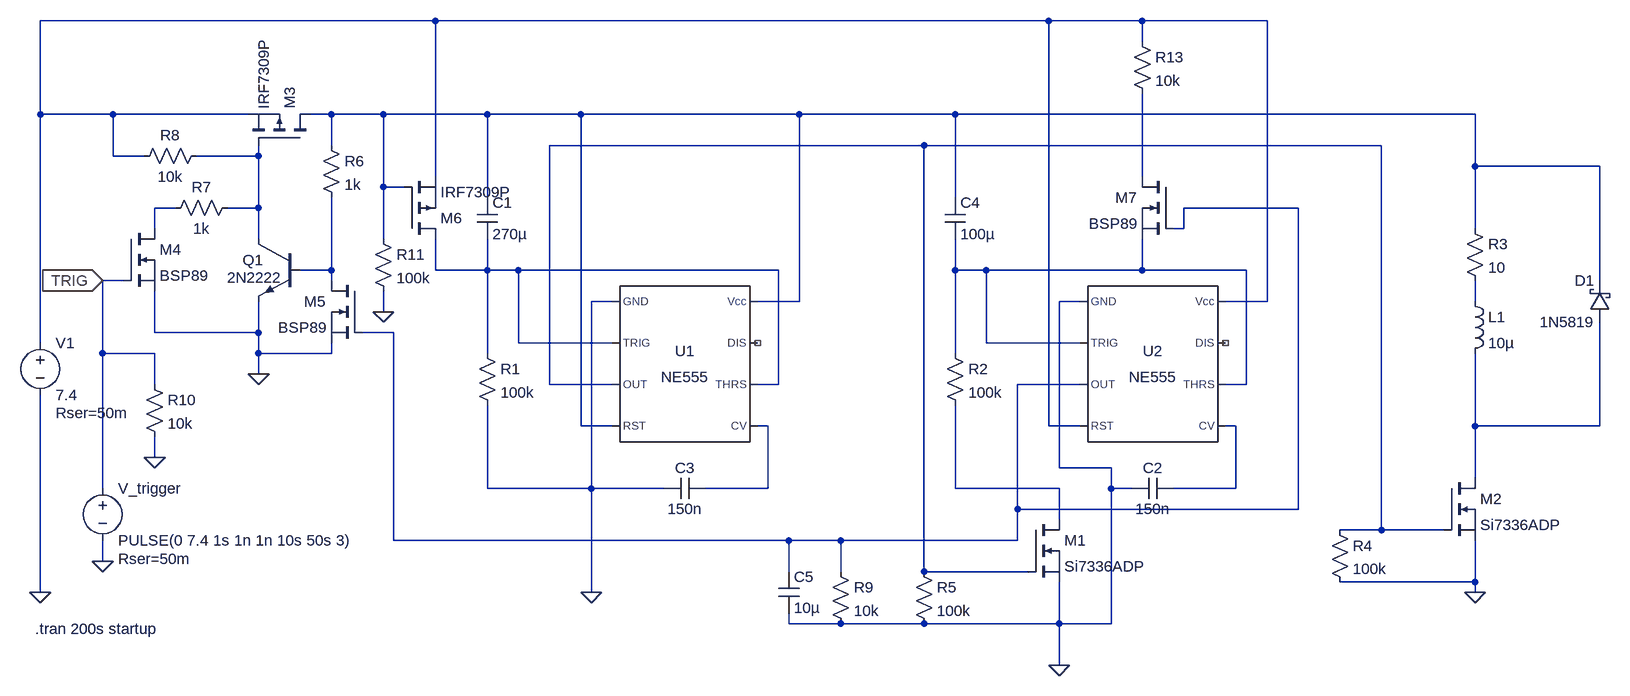
[diagram p0: schematic delayed_on_off_3.asc]
delayed_on_off_3.asc, the LTspice schematic file:
Version 4
SHEET 1 1796 680
WIRE -16 -336 -624 -336
WIRE 928 -336 -16 -336
WIRE 1072 -336 928 -336
WIRE 1264 -336 1072 -336
WIRE 1072 -304 1072 -336
WIRE -624 -192 -624 -336
WIRE -512 -192 -624 -192
WIRE -304 -192 -512 -192
WIRE -176 -192 -208 -192
WIRE -96 -192 -176 -192
WIRE 64 -192 -96 -192
WIRE 208 -192 64 -192
WIRE 544 -192 208 -192
WIRE 784 -192 544 -192
WIRE 1584 -192 784 -192
WIRE -176 -144 -176 -192
WIRE 736 -144 160 -144
WIRE 1440 -144 736 -144
WIRE -512 -128 -512 -192
WIRE -464 -128 -512 -128
WIRE -288 -128 -288 -144
WIRE -288 -128 -384 -128
WIRE 1584 -112 1584 -192
WIRE 1776 -112 1584 -112
WIRE -16 -96 -16 -336
WIRE 1072 -96 1072 -224
WIRE -96 -80 -96 -192
WIRE -64 -80 -96 -80
WIRE 64 -64 64 -192
WIRE 784 -64 784 -192
WIRE -416 -48 -448 -48
WIRE -288 -48 -288 -128
WIRE -288 -48 -336 -48
WIRE 1312 -48 1136 -48
WIRE -448 -16 -448 -48
WIRE 1136 -16 1136 -48
WIRE 1136 -16 1120 -16
WIRE 1584 -16 1584 -112
WIRE -288 0 -288 -48
WIRE -96 0 -96 -80
WIRE -176 48 -176 -64
WIRE -176 48 -224 48
WIRE -16 48 -16 0
WIRE 64 48 64 0
WIRE 64 48 -16 48
WIRE 112 48 64 48
WIRE 512 48 112 48
WIRE 784 48 784 0
WIRE 832 48 784 48
WIRE 1072 48 1072 0
WIRE 1072 48 832 48
WIRE 1232 48 1072 48
WIRE -496 64 -528 64
WIRE -176 64 -176 48
WIRE 1776 64 1776 -112
WIRE 256 96 224 96
WIRE 544 96 544 -192
WIRE 544 96 480 96
WIRE 976 96 944 96
WIRE 1264 96 1264 -336
WIRE 1264 96 1200 96
WIRE 1584 96 1584 64
WIRE -96 112 -96 80
WIRE -448 144 -448 80
WIRE -288 144 -288 96
WIRE -288 144 -448 144
WIRE -80 144 -128 144
WIRE -624 160 -624 -192
WIRE 112 160 112 48
WIRE 256 160 112 160
WIRE 832 160 832 48
WIRE 976 160 832 160
WIRE -528 176 -528 64
WIRE -448 176 -528 176
WIRE -288 176 -288 144
WIRE -176 176 -176 160
WIRE -176 176 -288 176
WIRE 64 176 64 48
WIRE 784 176 784 48
WIRE -288 208 -288 176
WIRE -448 224 -448 176
WIRE 160 224 160 -144
WIRE 256 224 160 224
WIRE 512 224 512 48
WIRE 512 224 480 224
WIRE 976 224 880 224
WIRE 1232 224 1232 48
WIRE 1232 224 1200 224
WIRE 208 288 208 -192
WIRE 256 288 208 288
WIRE 496 288 480 288
WIRE 928 288 928 -336
WIRE 976 288 928 288
WIRE 1216 288 1200 288
WIRE 1584 288 1584 176
WIRE 1776 288 1776 128
WIRE 1776 288 1584 288
WIRE -448 336 -448 304
WIRE 944 352 944 96
WIRE 1024 352 944 352
WIRE 1584 368 1584 288
WIRE -528 384 -528 176
WIRE 64 384 64 256
WIRE 224 384 224 96
WIRE 224 384 64 384
WIRE 336 384 224 384
WIRE 496 384 496 288
WIRE 496 384 400 384
WIRE 784 384 784 256
WIRE 944 384 784 384
WIRE 1024 384 1024 352
WIRE 1056 384 1024 384
WIRE 1216 384 1216 288
WIRE 1216 384 1120 384
WIRE 880 416 880 224
WIRE 1312 416 1312 -48
WIRE 1312 416 880 416
WIRE 944 432 944 384
WIRE 1440 448 1440 -144
WIRE 1440 448 1376 448
WIRE 1536 448 1440 448
WIRE -80 464 -80 144
WIRE 528 464 -80 464
WIRE 608 464 528 464
WIRE 880 464 880 416
WIRE 880 464 608 464
WIRE -528 496 -528 464
WIRE 528 512 528 464
WIRE 608 512 608 464
WIRE 736 512 736 -144
WIRE 896 512 736 512
WIRE 1584 528 1584 464
WIRE 1584 528 1376 528
WIRE -624 544 -624 240
WIRE 224 544 224 384
WIRE 1584 544 1584 528
WIRE 528 592 528 576
WIRE 608 592 528 592
WIRE 736 592 608 592
WIRE 944 592 944 528
WIRE 944 592 736 592
WIRE 1024 592 1024 384
WIRE 1024 592 944 592
WIRE 944 656 944 592
FLAG 1584 544 0
FLAG -624 544 0
FLAG 224 544 0
FLAG -288 208 0
FLAG -528 496 0
FLAG -448 336 0
FLAG 944 656 0
FLAG -96 112 0
FLAG -528 64 TRIG
IOPIN -528 64 In
SYMBOL Misc\\NE555 368 192 R0
SYMATTR InstName U1
SYMBOL voltage -624 144 R0
WINDOW 123 0 0 Left 0
WINDOW 39 24 124 Left 2
SYMATTR SpiceLine Rser=50m
SYMATTR InstName V1
SYMATTR Value 7.4
SYMBOL cap 400 368 R90
WINDOW 0 0 32 VBottom 2
WINDOW 3 32 32 VTop 2
SYMATTR InstName C3
SYMATTR Value 150n
SYMBOL cap 48 -64 R0
SYMATTR InstName C1
SYMATTR Value 270µ
SYMBOL res 48 160 R0
SYMATTR InstName R1
SYMATTR Value 100k
SYMBOL nmos 1536 368 R0
SYMATTR InstName M2
SYMATTR Value Si7336ADP
SYMBOL res 1568 -32 R0
SYMATTR InstName R3
SYMATTR Value 10
SYMBOL res 1360 432 R0
SYMATTR InstName R4
SYMATTR Value 100k
SYMBOL pmos -208 -144 M270
SYMATTR InstName M3
SYMATTR Value IRF7309P
SYMBOL npn -224 0 M0
WINDOW 3 28 59 Left 2
SYMATTR Value 2N2222
SYMATTR InstName Q1
SYMBOL voltage -528 368 R0
WINDOW 123 0 0 Left 0
WINDOW 39 24 124 Left 2
SYMATTR SpiceLine Rser=50m
SYMATTR InstName V_trigger
SYMATTR Value PULSE(0 7.4 1s 1n 1n 10s 50s 3)
SYMBOL res -368 -144 R90
WINDOW 0 0 56 VBottom 2
WINDOW 3 32 56 VTop 2
SYMATTR InstName R8
SYMATTR Value 10k
SYMBOL nmos -496 -16 R0
SYMATTR InstName M4
SYMATTR Value BSP89
SYMBOL res -320 -64 R90
WINDOW 0 0 56 VBottom 2
WINDOW 3 32 56 VTop 2
SYMATTR InstName R7
SYMATTR Value 1k
SYMBOL res -464 208 R0
SYMATTR InstName R10
SYMATTR Value 10k
SYMBOL Misc\\NE555 1088 192 R0
SYMATTR InstName U2
SYMBOL cap 1120 368 R90
WINDOW 0 0 32 VBottom 2
WINDOW 3 32 32 VTop 2
SYMATTR InstName C2
SYMATTR Value 150n
SYMBOL cap 768 -64 R0
SYMATTR InstName C4
SYMATTR Value 100µ
SYMBOL res 768 160 R0
SYMATTR InstName R2
SYMATTR Value 100k
SYMBOL nmos 896 432 R0
SYMATTR InstName M1
SYMATTR Value Si7336ADP
SYMBOL res 720 496 R0
SYMATTR InstName R5
SYMATTR Value 100k
SYMBOL nmos -128 64 M0
SYMATTR InstName M5
SYMATTR Value BSP89
SYMBOL res 592 496 R0
SYMATTR InstName R9
SYMATTR Value 10k
SYMBOL cap 512 512 R0
SYMATTR InstName C5
SYMATTR Value 10µ
SYMBOL res -192 -160 R0
SYMATTR InstName R6
SYMATTR Value 1k
SYMBOL pmos -64 0 M180
SYMATTR InstName M6
SYMATTR Value IRF7309P
SYMBOL res -112 -16 R0
SYMATTR InstName R11
SYMATTR Value 100k
SYMBOL res 1056 -320 R0
SYMATTR InstName R13
SYMATTR Value 10k
SYMBOL nmos 1120 -96 M0
SYMATTR InstName M7
SYMATTR Value BSP89
SYMBOL ind 1568 80 R0
SYMATTR InstName L1
SYMATTR Value 10µ
SYMBOL schottky 1792 128 R180
WINDOW 0 24 64 Left 2
WINDOW 3 24 0 Left 2
SYMATTR InstName D1
SYMATTR Value 1N5819
SYMATTR Description Diode
SYMATTR Type diode
TEXT -632 600 Left 2 !.tran 200s startup

The netlist it stands for:
* delayed_on_off_3.asc
XU1 0 N009 N003 N002 N012 N009 NC_01 N002 NE555  ; pins GND TRIG OUT RST CV THRS DIS Vcc
V1 N001 0 7.4 Rser=50m
C3 N012 0 150n
C1 N002 N009 270µ
R1 N009 0 100k
M2 N014 N003 0 0 Si7336ADP
R3 N002 N011 10
R4 N003 0 100k
M3 N002 N004 N001 N001 IRF7309P
Q1 N004 N008 0 0 2N2222
V_trigger TRIG 0 PULSE(0 7.4 1s 1n 1n 10s 50s 3) Rser=50m
R8 N004 N001 10k
M4 N006 TRIG 0 0 BSP89
R7 N004 N006 1k
R10 TRIG 0 10k
XU2 0 N010 N007 N001 N013 N010 NC_02 N001 NE555  ; pins GND TRIG OUT RST CV THRS DIS Vcc
C2 N013 0 150n
C4 N002 N010 100µ
R2 N010 N015 100k
M1 N015 N003 0 0 Si7336ADP
R5 N003 0 100k
M5 N008 N007 0 0 BSP89
R9 N007 0 10k
C5 N007 0 10µ
R6 N002 N008 1k
M6 N009 N002 N001 N001 IRF7309P
R11 N002 0 100k
R13 N001 N005 10k
M7 N005 N007 N010 N010 BSP89
L1 N011 N014 10µ
D1 N014 N002 1N5819
.model D D
.lib standard.dio
.model NPN NPN
.model PNP PNP
.lib standard.bjt
.model NMOS NMOS
.model PMOS PMOS
.lib standard.mos
.tran 200s startup
.lib NE555.sub
.backanno
.end